# Altium schematic sheet 3_5_inch.SchDoc
size A3; CompanyName: KDS; Organization: KDS; DocumentNumber: 4; Revision: V1I1; SheetNumber: 4; SheetTotal: 4; PageSetup: Record=PageOptions|CenterHorizontal=True|CenterVertical=True|PrintScale=1.07|XCorrection=1.00|YCorrection=1.00|PrintKind=1|BorderSize=5000000|LeftOffset=0|BottomOffset=0|Orientation=2|PaperLength=1000|PaperWidth=1000|Scale=100|PaperSource=7|PrintQuality=600|MediaType=1|DitherType=10|PaperKind=A3|PrintScaleMode=1; ProjectName: KDS C6A816x Module
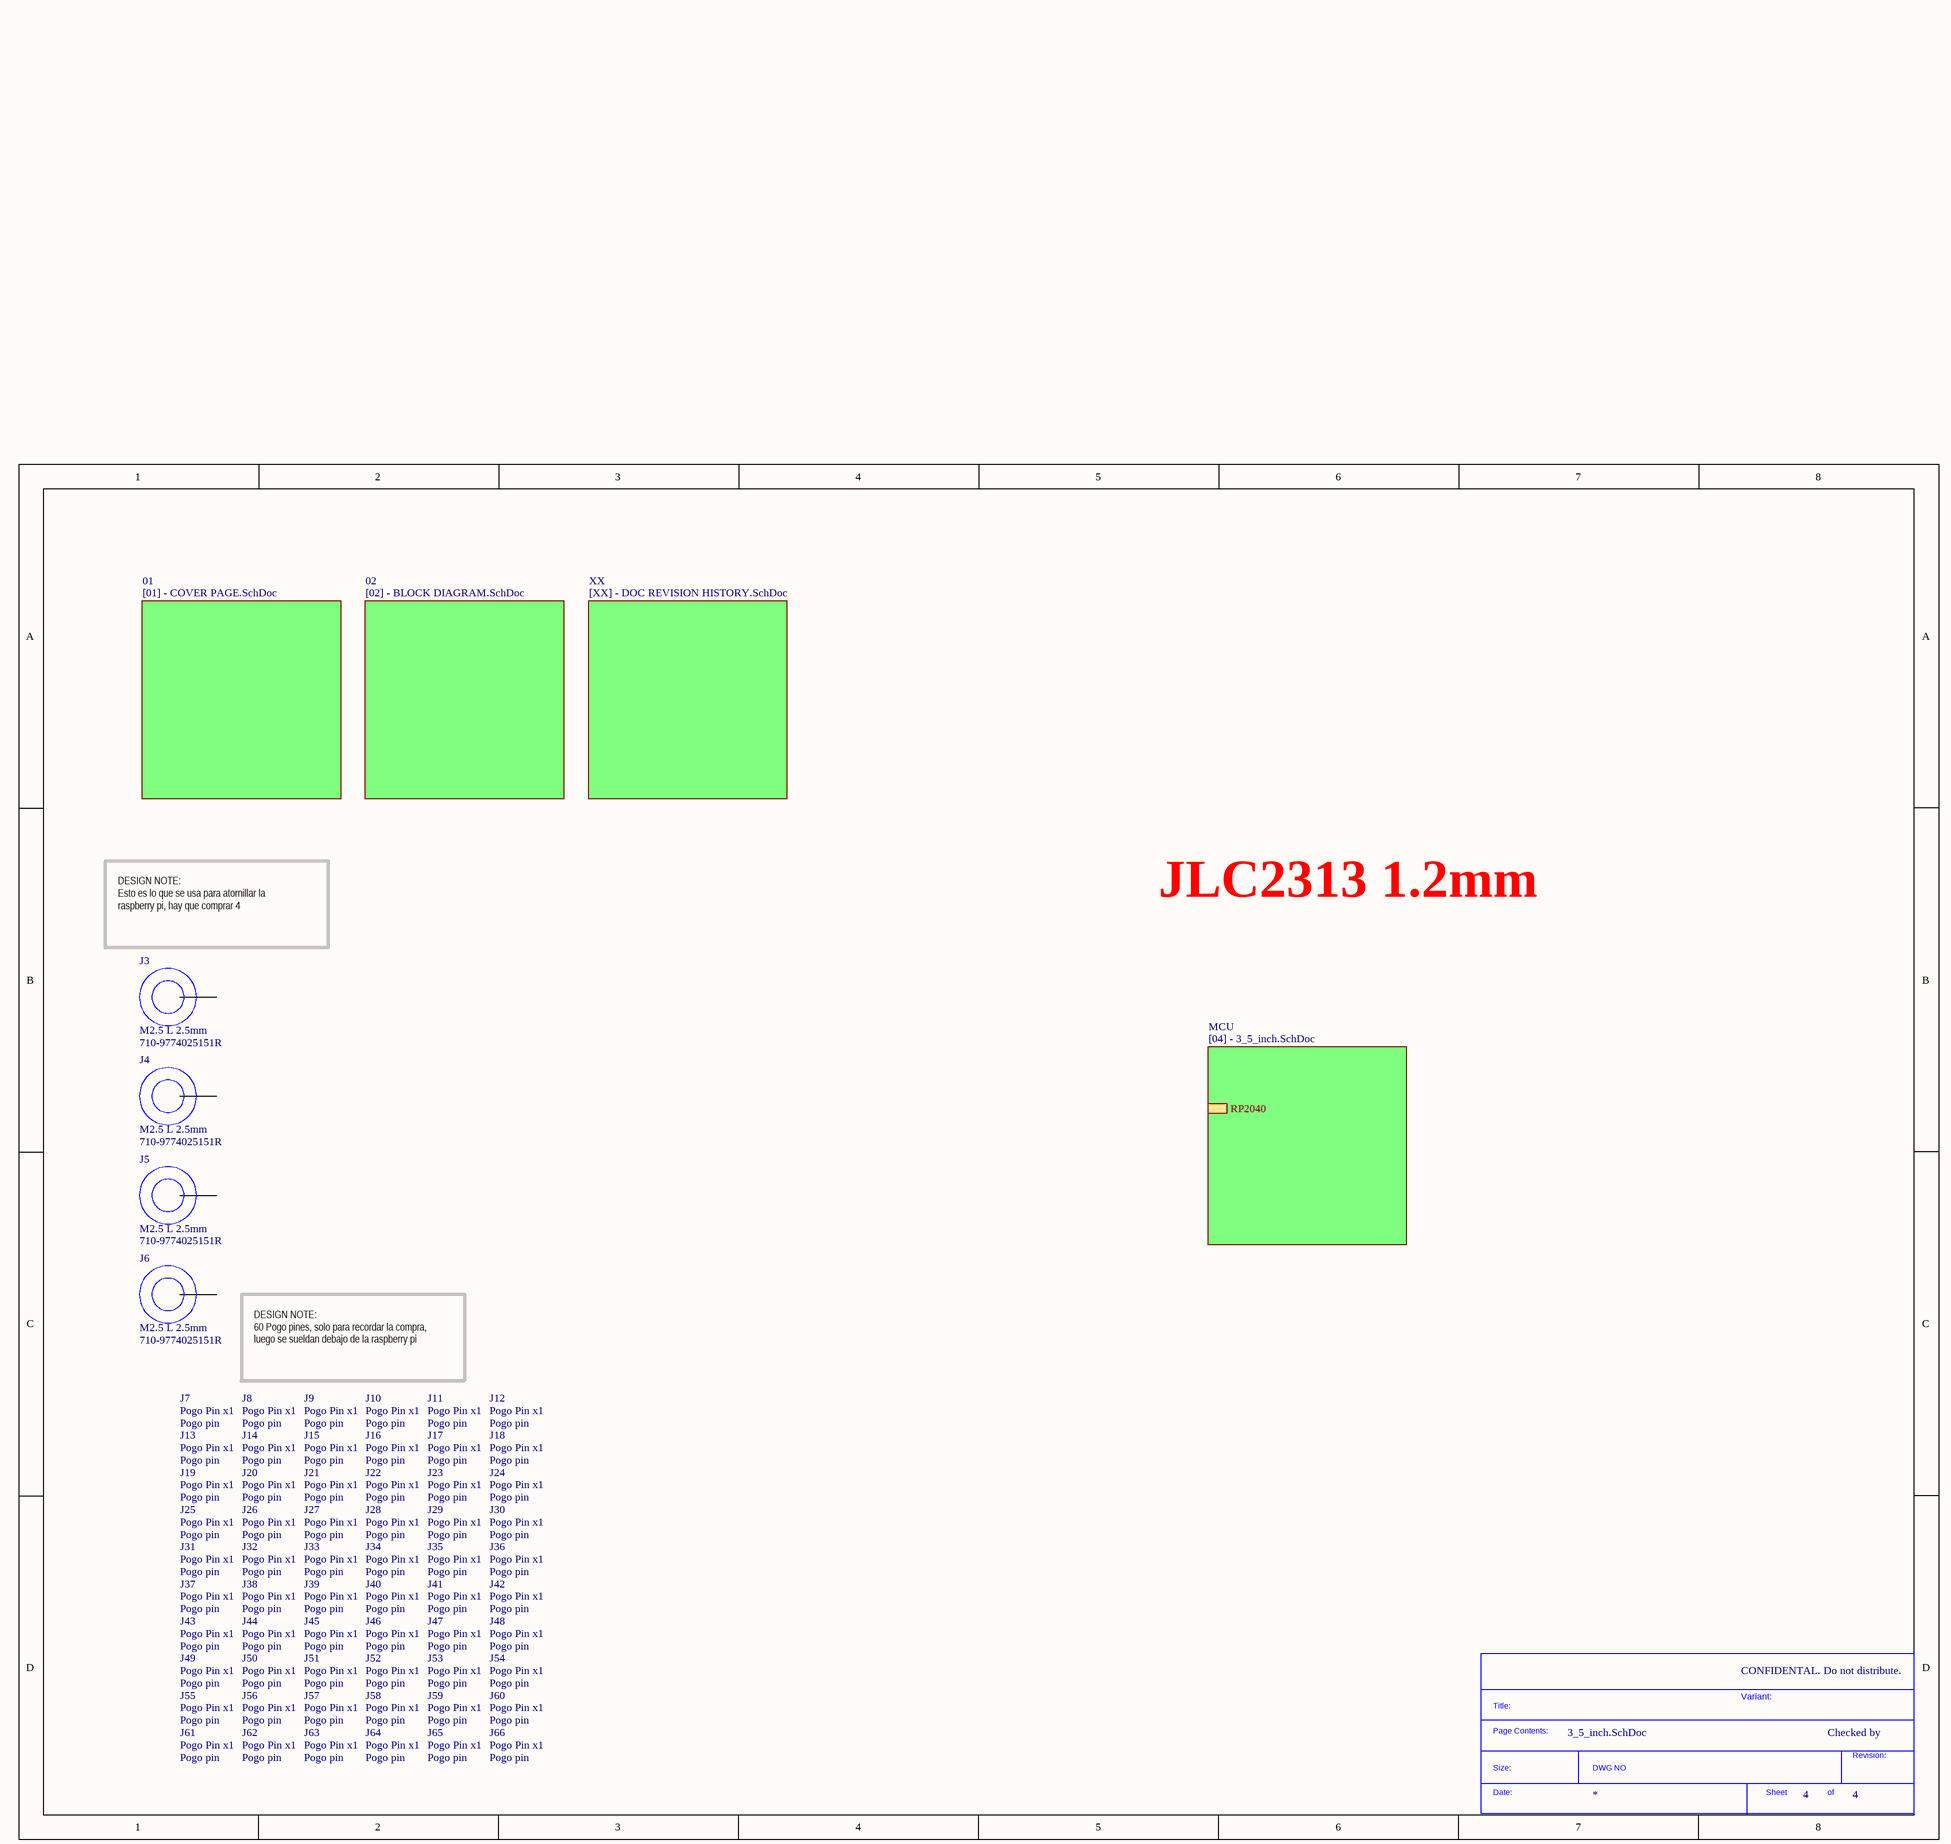
[diagram p0: 3_5_inch.SchDoc]

## Parts
*  SDTitleBlock  (value not drawn)  (graphical)
J3  M2.5 L 2.5mm  Supplier Part Number 1: 710-9774025151R  (mechanical)
J4  M2.5 L 2.5mm  Supplier Part Number 1: 710-9774025151R  (mechanical)
J5  M2.5 L 2.5mm  Supplier Part Number 1: 710-9774025151R  (mechanical)
J6  M2.5 L 2.5mm  Supplier Part Number 1: 710-9774025151R  (mechanical)
J7  Pogo pin  (mechanical)
J8  Pogo pin  (mechanical)
J9  Pogo pin  (mechanical)
J10  Pogo pin  (mechanical)
J11  Pogo pin  (mechanical)
J12  Pogo pin  (mechanical)
J13  Pogo pin  (mechanical)
J14  Pogo pin  (mechanical)
J15  Pogo pin  (mechanical)
J16  Pogo pin  (mechanical)
J17  Pogo pin  (mechanical)
J18  Pogo pin  (mechanical)
J19  Pogo pin  (mechanical)
J20  Pogo pin  (mechanical)
J21  Pogo pin  (mechanical)
J22  Pogo pin  (mechanical)
J23  Pogo pin  (mechanical)
J24  Pogo pin  (mechanical)
J25  Pogo pin  (mechanical)
J26  Pogo pin  (mechanical)
J27  Pogo pin  (mechanical)
J28  Pogo pin  (mechanical)
J29  Pogo pin  (mechanical)
J30  Pogo pin  (mechanical)
J31  Pogo pin  (mechanical)
J32  Pogo pin  (mechanical)
J33  Pogo pin  (mechanical)
J34  Pogo pin  (mechanical)
J35  Pogo pin  (mechanical)
J36  Pogo pin  (mechanical)
J37  Pogo pin  (mechanical)
J38  Pogo pin  (mechanical)
J39  Pogo pin  (mechanical)
J40  Pogo pin  (mechanical)
J41  Pogo pin  (mechanical)
J42  Pogo pin  (mechanical)
J43  Pogo pin  (mechanical)
J44  Pogo pin  (mechanical)
J45  Pogo pin  (mechanical)
J46  Pogo pin  (mechanical)
J47  Pogo pin  (mechanical)
J48  Pogo pin  (mechanical)
J49  Pogo pin  (mechanical)
J50  Pogo pin  (mechanical)
J51  Pogo pin  (mechanical)
J52  Pogo pin  (mechanical)
J53  Pogo pin  (mechanical)
J54  Pogo pin  (mechanical)
J55  Pogo pin  (mechanical)
J56  Pogo pin  (mechanical)
J57  Pogo pin  (mechanical)
J58  Pogo pin  (mechanical)
J59  Pogo pin  (mechanical)
J60  Pogo pin  (mechanical)
J61  Pogo pin  (mechanical)
J62  Pogo pin  (mechanical)
J63  Pogo pin  (mechanical)
J64  Pogo pin  (mechanical)
J65  Pogo pin  (mechanical)
J66  Pogo pin  (mechanical)

## Sub-sheets
01 = [01] - COVER PAGE.SchDoc: no entries
02 = [02] - BLOCK DIAGRAM.SchDoc: no entries
MCU = [04] - 3_5_inch.SchDoc: RP2040 (harness RP2040)
XX = [XX] - DOC REVISION HISTORY.SchDoc: no entries

## Nets

Not connected (* = marked no-connect by the designer): J3 1; J4 1; J5 1; J6 1

## Notes on the sheet
- JLC2313 1.2mm
- DESIGN NOTE:
  Esto es lo que se usa para atornillar la raspberry pi, hay que comprar 4
- DESIGN NOTE:
  60 Pogo pines, solo para recordar la compra, luego se sueldan debajo de la raspberry pi
- CONFIDENTAL. Do not distribute.
- Variant:
- Checked by
- (in symbol 0906-0-15-20-76-14-11-0) Pogo Pin x1
- (in symbol SDTitleBlock) Title:; Page Contents:; Revision:; Size:; DWG NO; Date:; Sheet; of

## Library data of the parts
J3-J6 = 9774025151R: Spacer Material: Steel Mounting: SMT Series: WA-SMSI Thread D: M2.5; Manufacturer: Wurth Electronics; Plating: Tin; Threaded/Unthreaded: Threaded; Outside Diameter: 0.201inch; Supplier 1: Mouser; Manufacturer Part Number: 9774025151R; RoHS: Yes; Category: Spacers, Standoffs; Stock 1: 24227; Pricing 1: 1=1,27000, 10=1,22000, 50=1,07000, 100=0,97900, 500=0,90700, 1000=0,90700, 10000=0,90700 (USD); Material: Steel; Length: 0.154inch; REACH SVHC: Unknown; ComponentLink1URL: http://www.farnell.com/datasheets/1960364.pdf?src-supplier=Farnell; ComponentLink1Description: http://www.farnell.com/datasheets/1960364.pdf?src-supplier=Farnell; ComponentLink2URL: http://www.mouser.com/ds/2/445/9774025151R-611453.pdf?src-supplier=Mouser; ComponentLink2Description: http://www.mouser.com/ds/2/445/9774025151R-611453.pdf?src-supplier=Mouser; ComponentLink3URL: https://media.digikey.com/pdf/Data%20Sheets/Wurth%20Electronics%20PDFs/WA-SMSx_Performance_Flyer.pdf?src-supplier=Digi-Key; ComponentLink3Description: https://media.digikey.com/pdf/Data%20Sheets/Wurth%20Electronics%20PDFs/WA-SMSx_Performance_Flyer.pdf?src-supplier=Digi-Key; ComponentLink4URL: http://www.farnell.com/datasheets/1960364.pdf?src-supplier=Element14; ComponentLink4Description: http://www.farnell.com/datasheets/1960364.pdf?src-supplier=Element14; ComponentLink5URL: http://www.farnell.com/datasheets/1960364.pdf?src-supplier=Newark; ComponentLink5Description: http://www.farnell.com/datasheets/1960364.pdf?src-supplier=Newark
J7-J66 = 0906-0-15-20-76-14-11-0: 0906 Series Spring-Loaded Pin Shell Material=Brass Alloy; Manufacturer: Mill-Max; Supplier 1: Mouser; Manufacturer Part Number: 0906-0-15-20-76-14-11-0; RoHS: Yes; Category: Connectors; Stock 1: 63461; Pricing 1: 1=0,56000, 10=0,42300, 50=0,42300, 100=0,37000, 500=0,35200, 1000=0,29000, 2500=0,25500, 10000=0,23400, 30000=0,22800, 50000=0,22000 (USD); ComponentLink1URL: https://datasheet.ciiva.com/16427/0906-0-15-20-76-14-11-0-16427148.pdf?src-supplier=Future+Electronics; ComponentLink1Description: https://datasheet.ciiva.com/16427/0906-0-15-20-76-14-11-0-16427148.pdf?src-supplier=Future+Electronics; ComponentLink2URL: https://datasheet.ciiva.com/16886/70206242-16886092.pdf?src-supplier=Allied+Electronics; ComponentLink2Description: https://datasheet.ciiva.com/16886/70206242-16886092.pdf?src-supplier=Allied+Electronics; Supplier Part Number 1: 575-906015